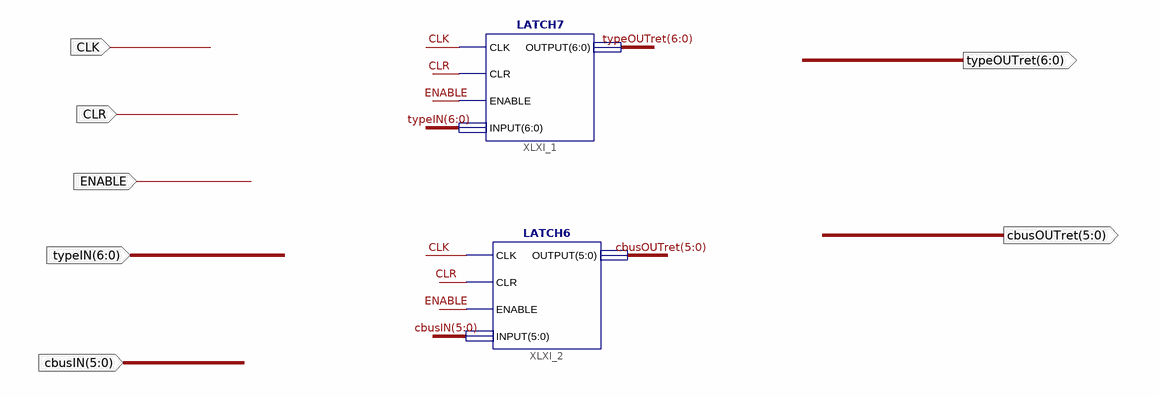
[diagram p0: schematic sheet 1]
// Xilinx ISE schematic toRetire.sch (artix7) as structural Verilog: 2 symbols, 7 ports
module toRetire (
  input  CLK,
  input  CLR,
  input  ENABLE,
  input  [6:0] typeIN,
  input  [5:0] cbusIN,
  output [6:0] typeOUTret,
  output [5:0] cbusOUTret
);

  LATCH7 XLXI_1 (.CLK(CLK), .CLR(CLR), .ENABLE(ENABLE), .INPUT(typeIN), .OUTPUT(typeOUTret));
  LATCH6 XLXI_2 (.CLK(CLK), .CLR(CLR), .ENABLE(ENABLE), .INPUT(cbusIN), .OUTPUT(cbusOUTret));
endmodule
